# EAGLE design EEZ AUX PS r4B42 (EAGLE 6.1)
Assembly variants: Farnell, TME

## Sheet 1 of 2
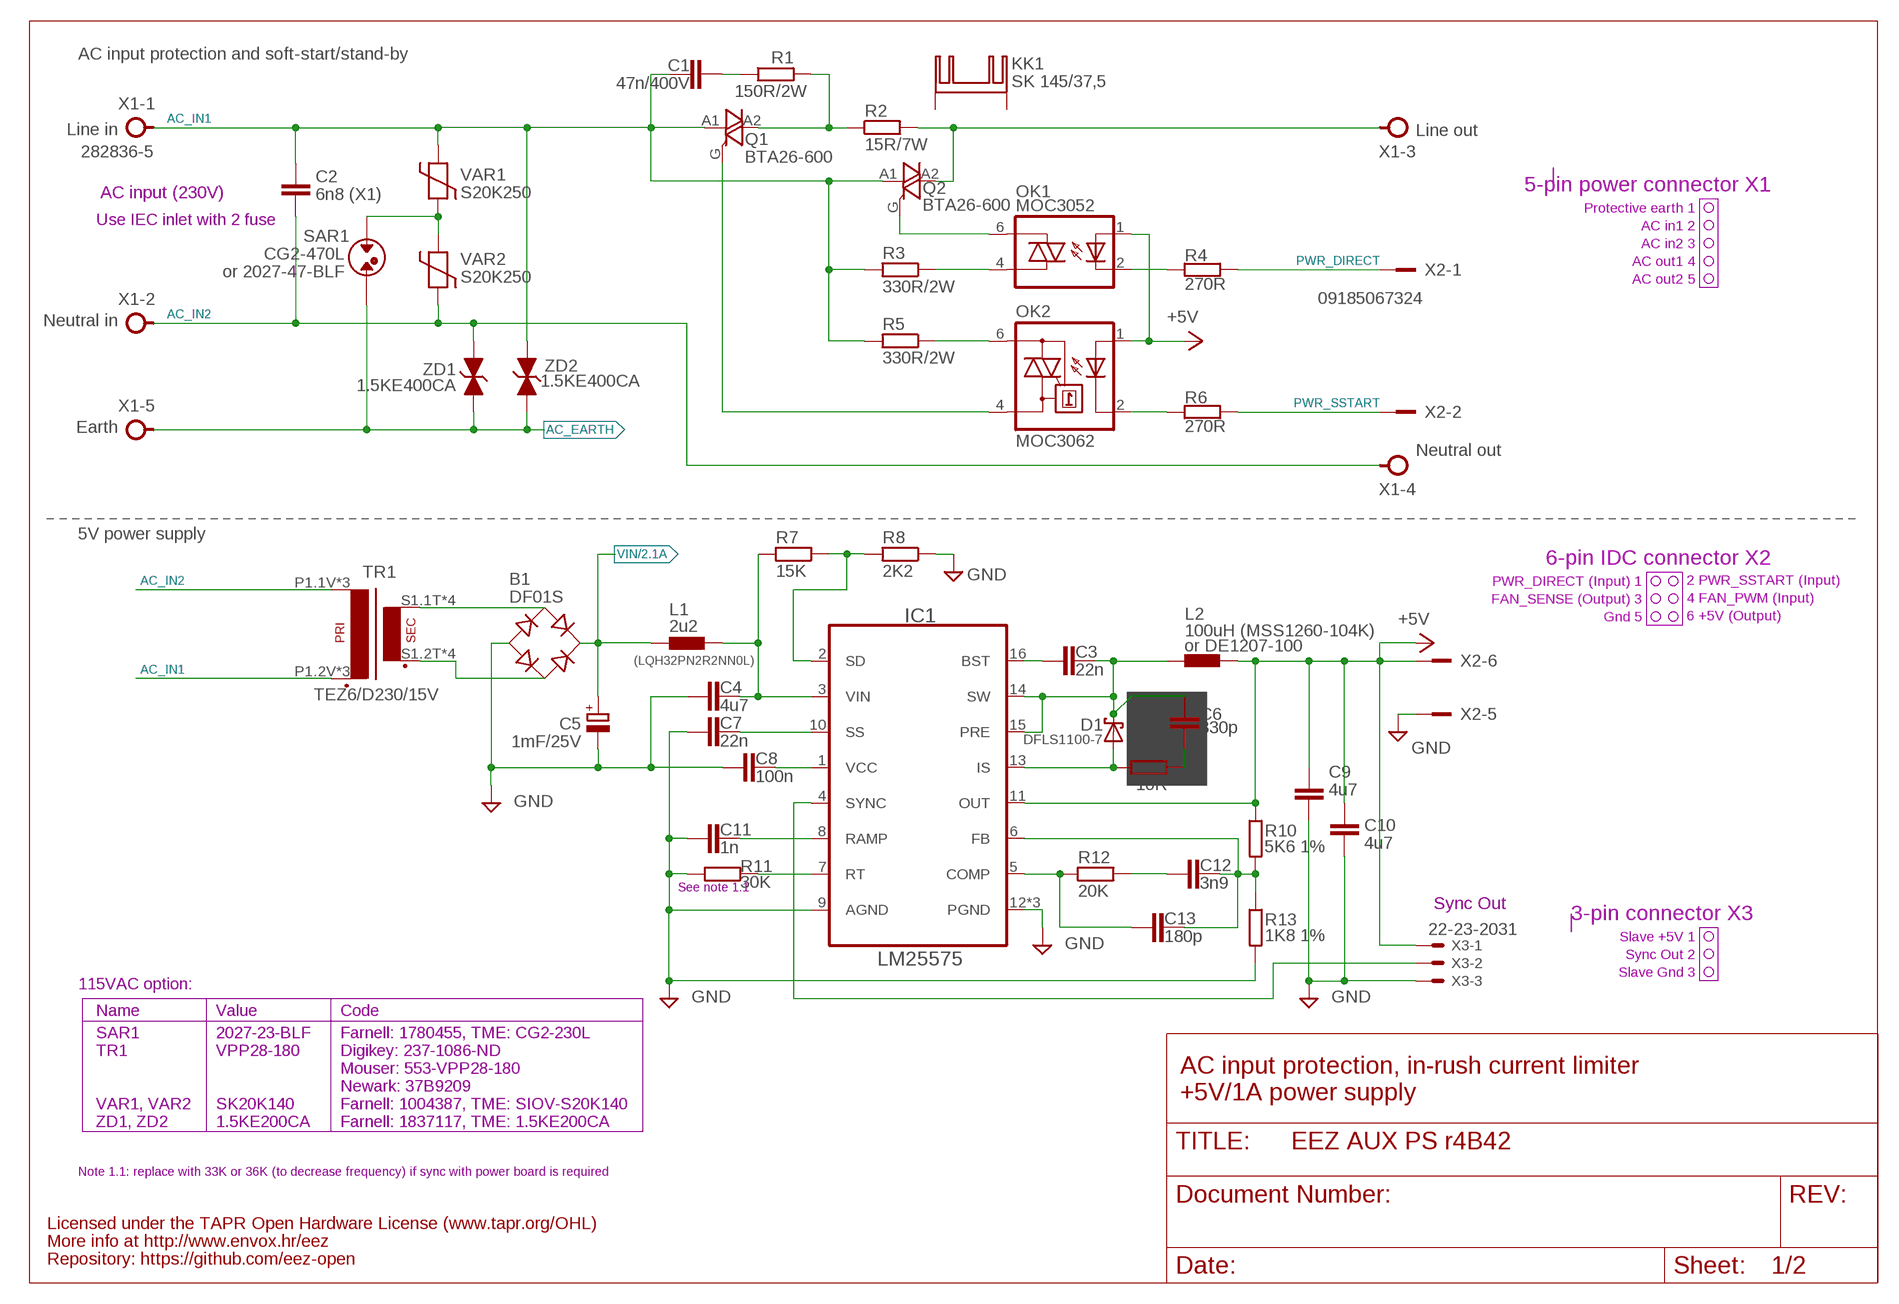
[diagram p0: schematic, sheet 1]

### Parts
B1  DF01S  [DFS]
C1  47n/400V  C-EU075-052X106  [C075-052X106]
C2  6n8 (X1)  C-EU102-064X133  [C102-064X133]
C3  22n  C-EUC0805  [C0805]
C4  4u7  C-EUC1210  [C1210]
C5  1mF/25V  ECAP5G_10.5MM  [ECAP5/10.5]
C6  330p  C-EUC0805  [C0805]
C7  22n  C-EUC0805  [C0805]
C8  100n  C-EUC0805  [C0805]
C9  4u7  C-EUC1210  [C1210]
C10  4u7  C-EUC1210  [C1210]
C11  1n  C-EUC0805  [C0805]
C12  3n9  C-EUC0805  [C0805]
C13  180p  C-EUC0805  [C0805]
D1  DFLS1100-7  SCHOTTKYSOD123  [SOD123]
IC1  LM25575  LM(2)5575  [SOP65P640X110-17N_HOLE]
KK1  SK 145/37,5  SK145  [SK145]
L1  2u2  L1210  [L1210]
L2  100uH (MSS1260-104K)  COILCRAFT_MSS1278  [MSS1278]
OK1  MOC3052  MOC305X  [DIL6-SMD]
OK2  MOC3062  MOC3033S  [DIL6-SMD]
Q1  BTA26-600  BTA26-V  [TOP3S-1]
Q2  BTA26-600  BTA26-V  [TOP3S-1]
R1  150R/2W  R-EU_R2512  [R2512]
R2  15R/7W  R_EU7W  [R_0913]
R3  330R/2W  R-EU_R2512  [R2512]
R4  270R  R-EU_R0805  [R0805]
R5  330R/2W  R-EU_R2512  [R2512]
R6  270R  R-EU_R0805  [R0805]
R7  15K  R-EU_R0805  [R0805]
R8  2K2  R-EU_R0805  [R0805]
R9  10R  R-EU_R1206  [R1206]
R10  5K6 1%  R-EU_R0805  [R0805]
R11  30K  R-EU_R0805  [R0805]
R12  20K  R-EU_R0805  [R0805]
R13  1K8 1%  R-EU_R0805  [R0805]
SAR1  CG2-470L  SAR  [SAR]
TR1  TEZ6/D230/15V  PCB_TRAFO6VA_TEZ+VPP  [PCB_TRAFO6VA_TEZ+VPP]
VAR1  S20K250  VARISTOR  [VARISTOR]
VAR2  S20K250  VARISTOR  [VARISTOR]
X1  282836-5  TBLOCK5.0_5A  [TBLOCK5.0_5]
X2  09185067324  IDC-6PIN  [IDC-6PIN]
X3  22-23-2031  [22-23-2031]
ZD1  1.5KE400CA  1.5KE-BIDIR  [DO201-BIDIR]
ZD2  1.5KE400CA  1.5KE-BIDIR  [DO201-BIDIR]

### Nets
+5V: C9.1 C10.1 IC1.11(OUT) L2.2 OK1.1(A) OK2.1(A) R10.1 X2.6 X3.1 ; also sheet 2
AC_EARTH: SAR1.P$2 X1.5 ZD1.C ZD2.C
AC_IN1: C1.2 C2.1 Q1.A1 Q2.A1 R3.2 R5.2 TR1.P1.2V(P2) TR1.P2.2V(P2) TR1.P2_TEZ(P2) VAR1.P$2 X1.1 ZD2.A
AC_IN2: C2.2 TR1.P1.1V(P1) TR1.P1_TEZ(P1) TR1.P2.1V(P1) VAR2.P$1 X1.2 X1.4 ZD1.A
DC_PREG1: C4.1 IC1.3(VIN) L1.2 R7.2
GND [gnd]: B1.- C4.2 C5.- C7.2 C8.1 C9.2 C10.2 C11.1 IC1.9(AGND) IC1.12(PGND) IC1.TP2(PGND) IC1.TP(PGND) R8.1 R11.2 R13.2 X2.5 X3.3 ; also sheet 2
IS: D1.A IC1.13(IS) R9.1
N$1: C6.2 R9.2
N$2: OK1.6(A2) Q2.G
N$3: OK1.4(A1) R3.1
N$4: OK2.4(A1) Q1.G
N$5: OK1.2(C) R4.1
N$6: OK2.2(C) R6.1
N$7: OK2.6(A2) R5.1
N$8: Q2.A2 R2.2 X1.3
N$9: B1.AC1 TR1.S1.1T(S1) TR1.S1.1V(S1) TR1.S2.1T(S1) TR1.S2.1V(S1)
N$13: IC1.4(SYNC) X3.2
N$15: C1.1 R1.1
N$20: B1.AC2 TR1.S1.2T(S2) TR1.S1.2V(S2) TR1.S2.2T(S2) TR1.S2.2V(S2)
N$25: Q1.A2 R1.2 R2.1
N$77: C12.2 R12.2
N$114: SAR1.P$1 VAR1.P$1 VAR2.P$2
N$128: C12.1 C13.1 IC1.6(FB) R10.2 R13.1
N$131: C3.2 IC1.16(BST)
N$135: C13.2 IC1.5(COMP) R12.1
N$165: IC1.7(RT) R11.1
N$166: C8.2 IC1.1(VCC)
N$167: C11.2 IC1.8(RAMP)
N$168: C7.1 IC1.10(SS)
N$180: IC1.2(SD) R7.1 R8.2
PWR_DIRECT: R4.2 X2.1
PWR_SSTART: R6.2 X2.2
SW: C3.1 C6.1 D1.C IC1.14(SW) IC1.15(PRE) L2.1
VIN: B1.+ C5.+ L1.1 ; also sheet 2
Unconnected: KK1.1(K) KK1.2(K)

### Notes on the sheet
- AC input protection and soft-start/stand-by
- Line in
- Line out
- 5-pin power connector X1
- AC input (230V)
- Protective earth 1
- AC in1 2
- Use IEC inlet with 2 fuse
- AC in2 3
- AC out1 4
- or 2027-47-BLF
- AC out2 5
- Neutral in
- Earth
- Neutral out
- 5V power supply
- 6-pin IDC connector X2
- PWR_DIRECT (Input) 1
- 2 PWR_SSTART (Input)
- FAN_SENSE (Output) 3
- 4 FAN_PWM (Input)
- Gnd 5
- 6 +5V (Output)
- or DE1207-100
- (LQH32PN2R2NN0L)
- See note 1.1
- Sync Out | 3-pin connector X3
- Slave +5V 1
- Sync Out 2
- Slave Gnd 3
- 115VAC option:
- Name | Value | Code
- SAR1 | 2027-23-BLF | Farnell: 1780455, TME: CG2-230L
- TR1 | VPP28-180 | Digikey: 237-1086-ND
- Mouser: 553-VPP28-180 | AC input protection, in-rush current limiter
- Newark: 37B9209
- +5V/1A power supply
- VAR1, VAR2 | SK20K140 | Farnell: 1004387, TME: SIOV-S20K140
- ZD1, ZD2 | 1.5KE200CA | Farnell: 1837117, TME: 1.5KE200CA
- Note 1.1: replace with 33K or 36K (to decrease frequency) if sync with power board is required
- Licensed under the TAPR Open Hardware License (www.tapr.org/OHL)
- More info at http://www.envox.hr/eez
- Repository: https://github.com/eez-open

## Sheet 2 of 2
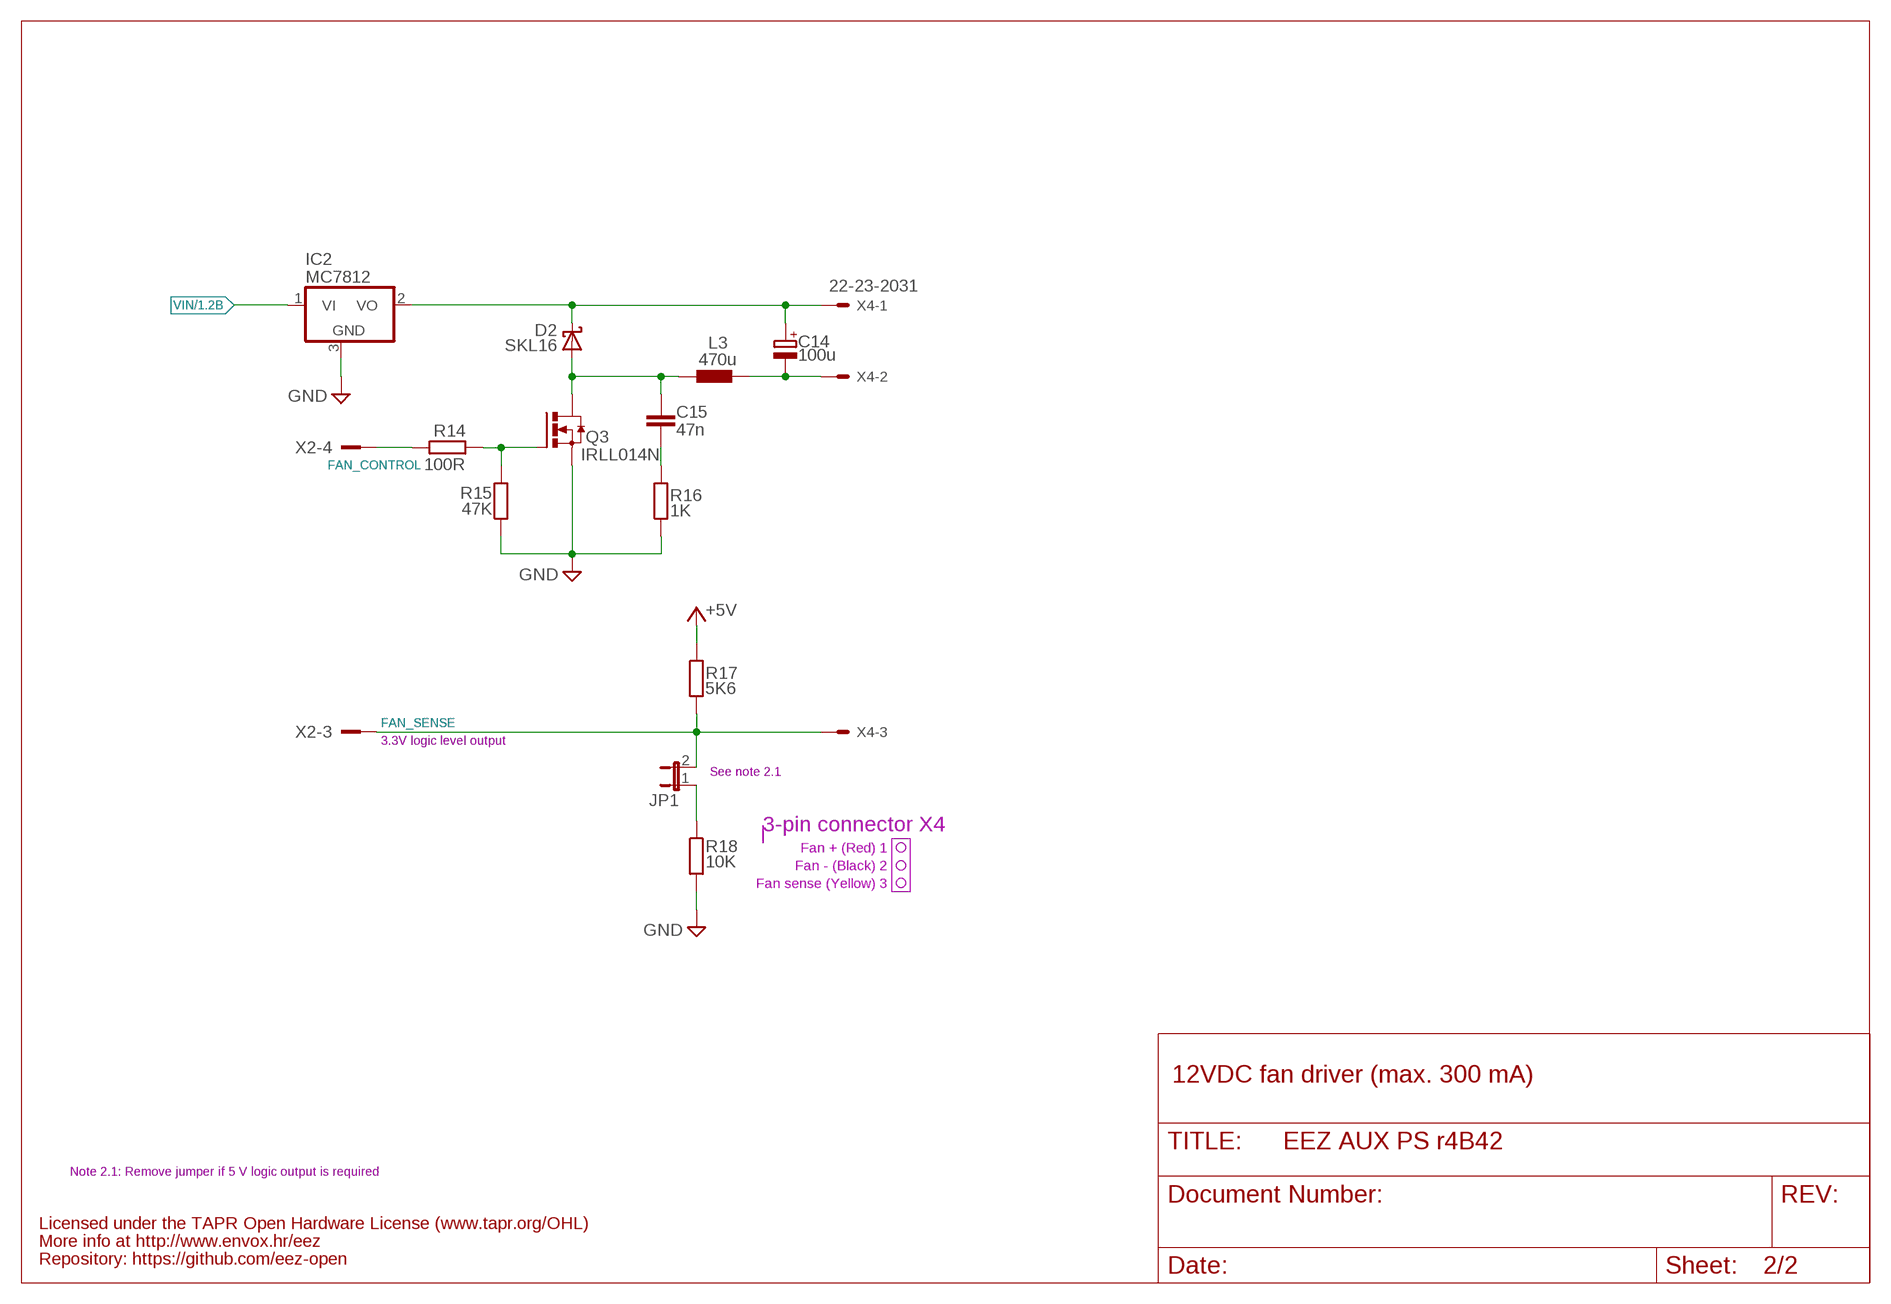
[diagram p1: schematic, sheet 2]

### Parts
C14  100u  ECAPPANASONIC_H  [CAPAE660X610N]
C15  47n  C-EUC0805  [C0805]
D2  SKL16  SCHOTTKYSOD123  [SOD123]
IC2  MC7812  MC78XX  [TO252]
JP1  JP1E  [JP1]
L3  470u  DE0704  [DE0704]
Q3  IRLL014N  N-HEXFET-2D_SOT232-IRLL014N  [SOT223]
R14  100R  R-EU_R0805  [R0805]
R15  47K  R-EU_R0805  [R0805]
R16  1K  R-EU_R0805  [R0805]
R17  5K6  R-EU_R0805  [R0805]
R18  10K  R-EU_R0805  [R0805]
X4  22-23-2031  [22-23-2031]

### Nets
+5V: R17.1 ; also sheet 1
FAN_CONTROL: R14.2 X2.4
FAN_OUT: C15.2 D2.A L3.2 Q3.2(D) Q3.4(D)
FAN_SENSE: JP1.2 R17.2 X2.3 X4.3
GND [gnd]: IC2.3(GND) Q3.3(S) R15.1 R16.1 R18.2 ; also sheet 1
N$10: JP1.1 R18.1
N$12: C15.1 R16.2
N$17: Q3.1(G) R14.1 R15.2
N$19: C14.1(+) D2.C IC2.2(VO) X4.1
N$21: C14.2(-) L3.1 X4.2
VIN: IC2.1(VI) ; also sheet 1

### Notes on the sheet
- 3.3V logic level output
- See note 2.1
- 3-pin connector X4
- Fan + (Red) 1
- Fan - (Black) 2
- Fan sense (Yellow) 3
- 12VDC fan driver (max. 300 mA)
- Note 2.1: Remove jumper if 5 V logic output is required
- Licensed under the TAPR Open Hardware License (www.tapr.org/OHL)
- More info at http://www.envox.hr/eez
- Repository: https://github.com/eez-open

## Library data of the parts
B1 = rectifier:DF*S: Surface Mount Glass Passivated Bridge Rectifiers Source: Source: Comchip Bridge Rectifiers DF005S-G thru DF10S-G.pdf
C1-C4 C6-C13 C15 = rcl:C-EU: CAPACITOR, European symbol
C5 C14 = EEZ_Lib1:ECAP
D1 D2 = EEZ_Lib1:SCHOTTKY
IC1 = EEZ_Lib1:LM(2)5575: Simple Switcher® 42V, 1.5A Step-Down Switching Regulator
IC2 = EEZ_Lib1:MC78XX: 1.0 A Positive Voltage Regulators
JP1 = jumper:JP1E: JUMPER
KK1 = EEZ_Lib1:SK145: FISCHER ELEKTRONIK SK 145/37,5 STS-220 Heat Sink, TO-220, TO-218, TO-220, TO-247, TO-248, 12 °C/W, 29 mm, 12 mm
L1 = EEZ_Lib1:L1210
L2 = EEZ_Lib1:COILCRAFT_MSS1278: Coilcraft SMT Power Inductors – MSS1278
L3 = EEZ_Lib1:DE0704: Ferrocore SMD power coil 7.3 x 7.3 mm
OK1 = EEZ_Lib1:MOC305X: 6-pin DIP Random-phase Optoisolators Triac Drivers (600V Peak)
OK2 = optocoupler:MOC30*: 6-Pin DIP Zero-Cross Optoisolators Triac Driver Output (250/400 Volt Peak) Source: http://www.fairchildsemi.com/ds/MO/MOC3043-M.pdf; MF: FAIRCHILD SEMICONDUCTOR; MPN: MOC3033S-M; OC_FARNELL: unknown; OC_NEWARK: 05C2878
Q1 Q2 = triac:BTA26: 25A TRIAC Source: http://www.st.com/stonline/products/literature/ds/7470.pdf
Q3 = transistor-power:N-HEXFET-2D_?-*: HEXFET® Power MOSFET 2 Drain connects http://www.irf.com/product-info/datasheets/data/irll014n.pdf
R1 R3-R18 = rcl:R-EU_: RESISTOR, European symbol
R2 = EEZ_Lib1:R_EU: RESISTOR - European symbol
SAR1 = EEZ_Lib1:SAR: EPCOS surge arrester EF470X Farnell: 1886596
TR1 = EEZ_Lib1:PCB_TRAFO6VA_TEZ+VPP: Breve Tufvassons TEZ 6/D or Triad Magnetics VPP; DIGIKEY: 237-1086-ND; MOUSER: 553-VPP28-180; NEWARK: 37B9209; TME: TEZ6/D/15-15V
VAR1 VAR2 = EEZ_Lib1:VARISTOR: EPCOS - B72220S0251K101 - VARISTOR, 140J, 250VAC Farnell: 1004357
X1 = EEZ_Lib1:TBLOCK5.0_5A
X2 = EEZ_Lib1:IDC-6PIN: 6-pin IDC socket male, straight; FARNELL: 1096984; TME: 09185067324
X3 X4 = con-molex:22-23-2031: .100" (2.54mm) Center Header - 3 Pin; MF: MOLEX; MPN: 22-23-2031; OC_FARNELL: 1462950; OC_NEWARK: 30C0862
ZD1 ZD2 = EEZ_Lib1:1.5KE-BIDIR

## Net classes
0 default: width 0.254 mm, drill 0.584 mm, clearance 0.254 mm
1 power: width 0.254 mm, drill 0.584 mm, clearance 0.254 mm
2 gnd: width 0.254 mm, drill 0.584 mm, clearance 0.254 mm

## Board
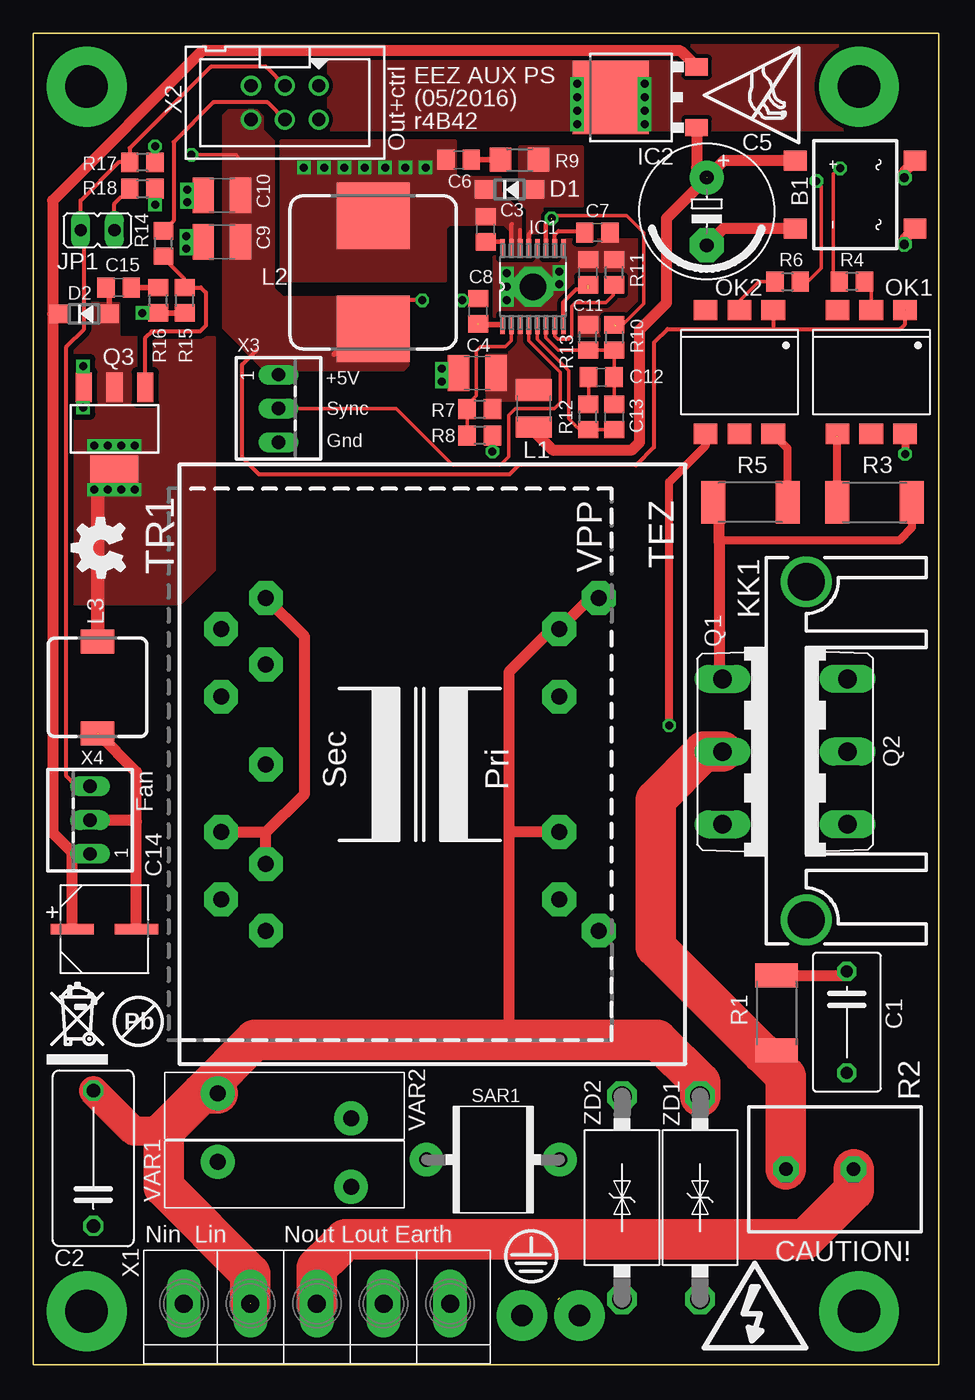
[diagram p2: board, top side]
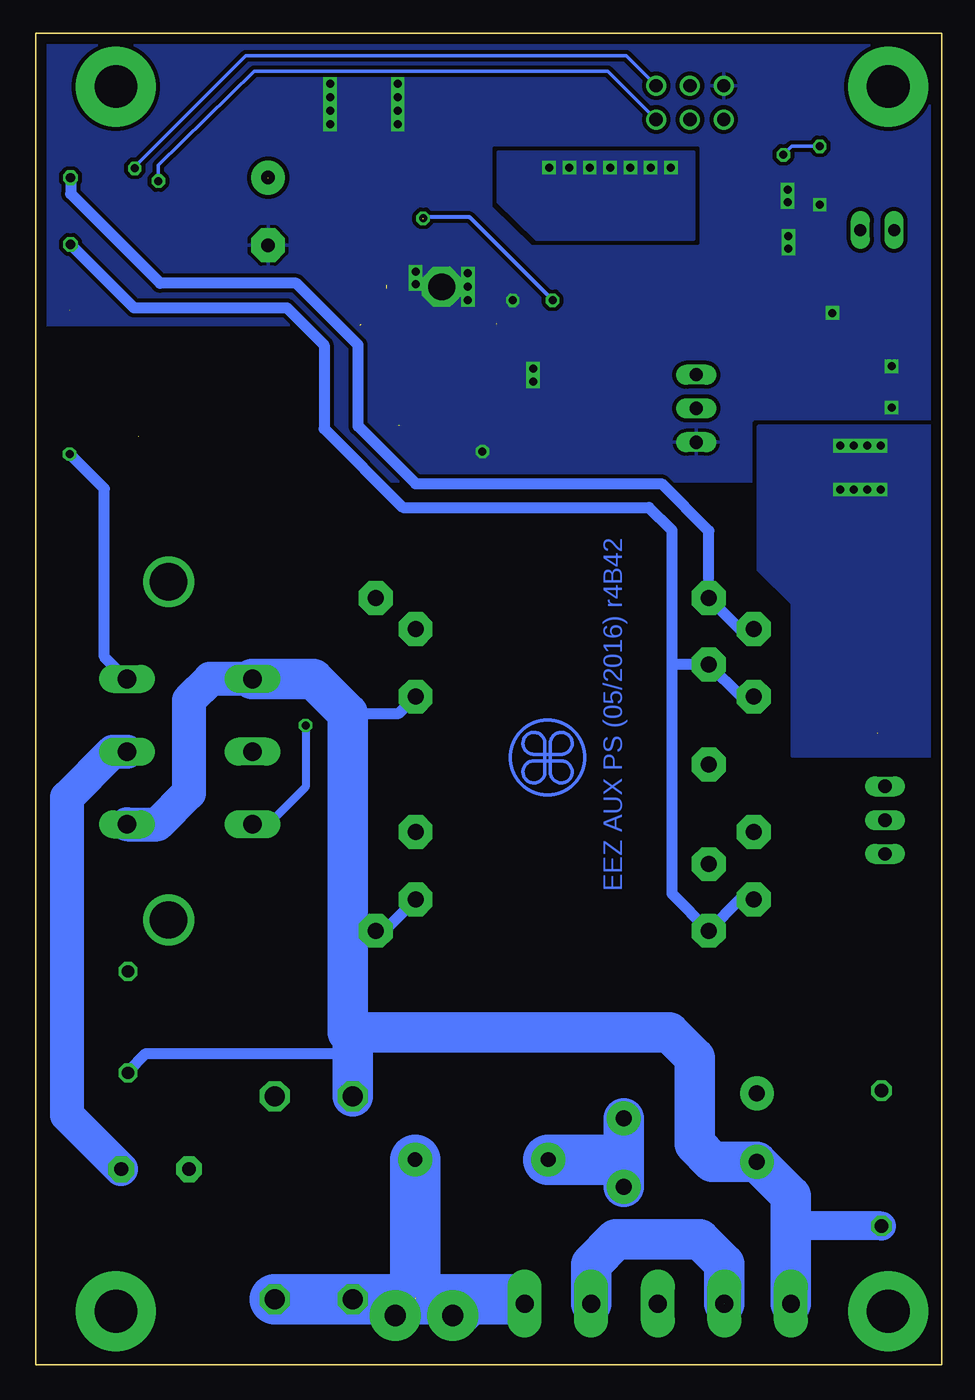
[diagram p3: board, bottom side, seen from below]

Size 68 x 100 mm. Coordinates in mm from the lower left corner, seen from the top.
Outline: 0,0 0,100 68,100 68,0 0,0
Copper layers (1+5*16): Top 0.035mm / dielectric 0.75mm / Route5 0.035mm / dielectric 0.75mm / Bottom 0.035mm
Design rules: minimum track width 10mil, minimum drill 0.5mm, track to track 8mil, track to pad 8mil, pad to pad 8mil, via to via 8mil, smd to smd 8mil, copper to edge 30mil, drill to drill 8mil, minimum pad ring 10mil, minimum via ring 8mil, stop-mask expansion 4mil, vias tented up to drill 25mil, thermal gap 10mil

### Footprints (pad centres in the part's own frame; a part is rotated, then mirrored left to right if it is on the bottom)
DFS = smd 1.5 x 1.7: + -2.55,-4.5; - 2.55,-4.5; AC1 -2.55,4.5; AC2 2.55,4.5
C075-052X106 = drill 0.914 octagon: 1 -3.81,0; 2 3.81,0
C102-064X133 = drill 1.016 octagon: 1 -5.08,0; 2 5.08,0
C0805 = smd 1.3 x 1.5: 1 -0.95,0; 2 0.95,0
C1210 = smd 1.6 x 2.7: 1 -1.4,0; 2 1.4,0
ECAP5/10.5 = drill 1.016 pad 2.54: + -2.54,0 | drill 1.016 pad 2.54 octagon: - 2.54,0
CAPAE660X610N = smd 3.251 x 0.762: 1 -2.413,0; 2 2.413,0
SOD123 = smd 1.4 x 1.4: A 1.9,0; C -1.9,0
SOP65P640X110-17N_HOLE = smd 1.422 x 0.356: 1 -2.845,2.286; 2 -2.845,1.626; 3 -2.845,0.965; 4 -2.845,0.33; 5 -2.845,-0.33; 6 -2.845,-0.965; 7 -2.845,-1.626; 8 -2.845,-2.286; 9 2.845,-2.286; 10 2.845,-1.626; 11 2.845,-0.965; 12 2.845,-0.33; 13 2.845,0.33; 14 2.845,0.965; 15 2.845,1.626; 16 2.845,2.286 | smd 2.032 x 2.032: TP 0,0 | drill 2 octagon: TP2 0,0
TO252 = smd 1.3 x 1.7: 1 -2.285,-5.49; 2 2.285,-5.49 | smd 5.5 x 5.7: 3 0,0.95
JP1 = drill 0.914 long: 1 0,-1.27; 2 0,1.27
SK145 = drill 2.8: 1 -12.7,0; 2 12.7,0
L1210 = smd 1.6 x 2.7: 1 -1.4,0; 2 1.4,0
MSS1278 = smd 5.5 x 5: 1 0,4.25; 2 0,-4.25
DE0704 = smd 2.5 x 1.8: 1 0,3.45; 2 0,-3.45
DIL6-SMD = smd 1.78 x 1.52: 1 -2.54,-4.645; 2 0,-4.645; 3 2.54,-4.645; 4 2.54,4.645; 5 0,4.645; 6 -2.54,4.645
TOP3S-1 = drill 1.397 long: A1 -5.461,-3.175; A2 0,-3.175; G 5.461,-3.175
SOT223 = smd 1.219 x 2.235: 1 -2.311,-3.099; 2 0,-3.099; 3 2.311,-3.099 | smd 3.6 x 2.2: 4 0,3.099
R2512 = smd 1.8 x 3.2: 1 -2.8,0; 2 2.8,0
R_0913 = drill 1.016 pad 1.93 octagon: 1 -3.556,0; 2 1.524,0
R0805 = smd 1.3 x 1.5: 1 -0.95,0; 2 0.95,0
R1206 = smd 1.6 x 1.803: 1 -1.422,0; 2 1.422,0
SAR = drill 1.1 pad 2.54: P$1 0,0; P$2 10,0
PCB_TRAFO6VA_TEZ+VPP = drill 1.2 pad 2.54 octagon: NC -12.5,0; P1.1V 9.525,10.16; P1.2V 9.525,5.08; P1_TEZ 12.5,12.5; P2.1V 9.525,-5.08; P2.2V 9.525,-10.16; P2_TEZ 12.5,-12.5; S1.1T -12.5,12.5; S1.1V -15.875,10.16; S1.2T -12.5,7.5; S1.2V -15.875,5.08; S2.1T -12.5,-7.5; S2.1V -15.875,-5.08; S2.2T -12.5,-12.5; S2.2V -15.875,-10.16
VARISTOR = drill 1.2 pad 2.54: P$1 -5,0.95; P$2 5,-0.95
TBLOCK5.0_5 = drill 1.35 pad 2.54 long: 1 0,0; 2 0,-5; 3 0,-10; 4 0,-15; 5 0,-20
IDC-6PIN = drill 1 pad 1.422: 1 -2.54,-1.27; 2 -2.54,1.27; 3 0,-1.27; 4 0,1.27; 5 2.54,-1.27; 6 2.54,1.27
22-23-2031 = drill 1 long: 1 -2.54,0; 2 0,0; 3 2.54,0
DO201-BIDIR = drill 1.499 octagon: A 7.62,0; C -7.62,0

### Placement (x,y rotation side)
B1  61.72,87.88 270 top
C1  61.09,25.72 270 top
C2  4.51,15.49 90 top
C3  33.97,85.28 270 top
C4  33.34,74.49 180 top
C5  50.57,86.62 270 top
C6  31.94,90.49 0 top
C7  42.35,85.03 0 top
C8  33.4,79.12 270 top
C9  14.16,84.33 180 top
C10  14.16,87.82 180 top
C11  41.66,82.04 270 top
C12  42.65,74.17 180 top
C13  43.62,71.18 270 top
C14  5.33,32.7 0 top
C15  6.41,80.9 180 top
D1  35.75,88.27 0 top
D2  3.81,78.93 0 top
EEZ_SIGNATURE  SIGNATURESMALL  [SIGNATURE_5MM]  29.58,45.59 270 top
IC1  37.53,80.96 90 top
IC2  44.32,95.19 90 top
JP1  4.83,85.22 90 top
KK1  58.04,46.1 270 top
L1  37.59,71.82 90 top
L2  25.53,82.04 0 top
L3  4.83,50.86 180 top
OK1  62.93,74.55 180 top
OK2  53.02,74.55 180 top
Q1  54.93,46.04 270 top
Q2  57.97,46.04 90 top
Q3  6.09,70.29 180 top
R1  55.82,26.42 270 top
R2  60.07,14.67 0 top
R3  63.18,64.77 0 top
R4  61.47,81.34 180 top
R5  53.85,64.77 180 top
R6  56.64,81.34 0 top
R7  33.53,71.75 0 top
R8  33.53,69.79 180 top
R9  36.51,90.49 180 top
R10  43.62,77.15 270 top
R11  43.62,82.04 90 top
R12  41.66,71.18 90 top
R13  41.66,77.15 90 top
R14  9.78,84.2 90 top
R15  11.37,79.95 90 top
R16  9.4,79.95 90 top
R17  8.19,90.3 180 top
R18  8.19,88.33 0 top
SAR1  29.53,15.39 0 top
TR1  29.97,45.09 0 top
U$2  [RECYCLE_BIN1/8]  1.02,22.54 0 top
U$3  [PB_SMALL]  7.88,25.78 0 top
U$4  [ESD_SYMBOL]  57.49,91.79 90 top
VAR1  18.86,14.29 180 top
VAR2  18.86,19.43 0 top
X1  11.3,4.57 90 top
X2  18.89,94.79 180 top
X3  18.41,71.82 270 top
X4  4.25,40.89 90 top
ZD1  50.06,12.54 90 top
ZD2  44.21,12.54 90 top

### Tracks (layer width: path | path; a pad name or v marks a point on that pad's centre or on a via)
+5V  (via drill 0.6)  (3 unrouted)
  Top 0.254: 38.92,86.04 39.18,86.3 44.58,86.3 45.85,85.03 45.85,79.69 44.26,78.11 43.75,78.11 43.69,78.04 | v11.87,90.87 15.24,90.87 15.37,90.74 | v9.14,91.5 R17.1
  Top 0.305: 23.11,76.26 23.05,76.33 23.56,76.33 24.95,77.72 | 24.95,77.72 25.02,77.79 | L2.2 24.89,77.79 24.95,77.72 | v29.21,79.95 27.24,79.95 25.08,77.79 | 16.76,76.2 15.68,75.12 15.68,68.14 16.95,66.86 35.75,66.86 36.45,67.56 45.27,67.56 46.61,68.9 46.61,76.77 47.62,77.79 55.56,77.79 | 55.56,77.79 65.09,77.79 65.47,78.17 OK1.1 | OK2.1 55.56,77.79
  Top 0.356: IC1.11 38.49,85.67 v38.92,86.11
  Top 0.406: 22.61,75.88 23.05,76.33
  Bottom 0.254: v9.14,91.5 11.24,91.5 v11.87,90.87
  Bottom 0.305: v29.21,79.95 35.43,86.17 38.86,86.17 v38.92,86.11
  pour Top (isolate 0.305, no thermals): 14.67,94.17 16.76,94.17 17.21,93.73 17.21,92.71 18.03,91.88 18.03,80.84 18.73,80.14 27.75,80.14 28.13,79.76 28.13,75.06 27.81,74.74 17.4,74.74 14.29,77.85 14.29,93.79
AC_EARTH  (via drill 1.6 pad 3.81)  (1 unrouted)
  Bottom 0.406: 40.32,4.95 41.02,4.95 v41.02,3.68 | 31.94,4.92 31.3,4.92 X1.5
  Bottom 3.81: ZD1.C ZD2.C 39.62,4.92 39.53,5.01 SAR1.P$2 | 35.43,4.92 39.43,4.92 40.32,4.95 | 35.43,4.92 31.94,4.92 | v36.7,3.68 35.43,4.92
AC_IN1
  Top 0.61: R3.2 65.98,62.87 65.02,61.91 51.62,61.91 51.5,61.78
  Top 0.813: R5.2 51.5,64.32 51.5,61.78 51.5,51.75 Q1.A1
  Bottom 0.813: 44.47,45.34 44.6,45.21 | 44.6,32.51 44.53,32.59 TR1.P2_TEZ 41.84,32.59 TR1.P2.2V | 44.6,48.92 40.74,48.92 TR1.P1.2V | C1.2 61.09,22.04 59.75,23.37 44.85,23.37 44.6,24.96
  Bottom 1.27: 11.18,10.41 11.3,10.54
  Bottom 2.184: C2.1 11.18,10.41
  Bottom 2.54: Q1.A1 54.93,51.5 56.51,49.91 56.51,42.93 58.86,40.58 Q2.A1
  Bottom 3.048: Q1.A1 47.18,51.5 44.6,48.92 44.6,45.21 44.6,32.51 44.6,25.34 | 44.6,25.34 44.6,24.96 20.45,24.96 | ZD2.A 44.21,24.94 44.6,25.34 | 20.45,24.96 18.54,23.05 18.54,16.57 17.2,15.24 VAR1.P$2 11.3,12.68 11.3,10.54 X1.1 | 20.45,24.96 20.45,24.89
AC_IN2  (1 unrouted)
  Top 0.813: TR1.P1_TEZ 41.84,57.59 TR1.P1.1V 38.95,55.24 35.71,52.01 35.71,39.81 | 35.71,39.81 35.71,24.47 35.62,24.38 | TR1.P2.1V 35.9,40.01 35.71,39.81
  Top 2.184: 9.78,17.53 7.55,17.53 C2.2
  Top 3.048: ZD1.A 50.06,21.18 46.86,24.38 35.62,24.38 16.64,24.38 12.63,20.38 | VAR2.P$1 12.63,20.38 | X1.2 16.3,6.81 9.78,13.34 9.78,17.53 12.63,20.38
  Bottom 3.048: X1.4 26.3,7.54 24.45,9.4 18.16,9.4 16.32,7.56 16.32,4.57
DC_PREG1
  pour Top (isolate 0.305, no thermals): 35.75,78.11 37.08,78.11 37.08,76.96 38.8,75.25 38.8,72.39 34.03,72.39 34.03,75.82 35.75,75.82
FAN_CONTROL
  Top 0.305: X2.4 17.61,94.81 13.52,94.81 10.54,91.82 10.54,85.91 R14.2
FAN_OUT  (via drill 0.6)
  Top 0.406: D2.A 5.71,80.65 C15.2
  Top 1.016: L3.2 4.83,65.91 6.16,67.25
  other vias: 4.57,65.72 5.59,65.72 6.6,65.72 7.62,65.72 4.57,69.02 5.59,69.02 6.6,69.02 7.62,69.02
  pour Top (isolate 0.406, no thermals): 13.59,77.15 13.59,59.69 11.05,57.15 1.14,57.15 1.14,79.69 6.41,79.69 6.41,77.15
  pour Bottom (isolate 0.406, no thermals): -0.57,45.72 11.18,45.72 11.18,57.15 13.71,59.69 13.71,70.48 -0.57,70.48
FAN_SENSE
  Top 0.305: X2.3 17.48,97.47 13.33,97.47 7.24,91.38 R17.2 | R17.2 | X4.3 3.24,43.43 2.48,44.2 2.48,76.45 3.81,77.79 3.81,84.96 JP1.2 3.55,87.44 6.42,90.3 R17.2
GND  (via drill 0.6)
  Top 0.254: v30.67,74.8 31.62,74.8 C4.2 | v34.48,68.58 R8.1
  Top 0.305: v11.56,87.31 12.25,87.31 C10.2 | C8.1 v32.19,79.95 | v11.49,83.82 12.32,83.82 C9.2 | v9.14,87.12 R18.2
  Top 0.406: v3.75,71.88 3.75,73.39 Q3.3 | v8.19,78.99 R16.1 R15.1
  Top 0.813: B1.- 51.83,85.33 C5.-
  other vias: 11.56,88.27 11.49,84.77 35.56,81.97 35.56,80.96 35.56,79.96 30.67,73.85 39.5,82.09 39.5,81.15 45.91,96.2 40.83,96.2 40.83,95.19 40.83,94.17 45.91,95.19 45.91,94.17 3.75,74.99 45.91,93.15 40.83,93.15
  pour Top (isolate 0.305, no thermals): 34.61,83.19 39.94,83.19 39.94,84.45 45.4,84.45 45.4,77.28 40.83,77.28 40.83,78.74 34.61,78.74
  pour Bottom (isolate 0.305, rank 2): 0.06,100.01 68.01,100.01 68.01,78.11 48.32,78.11 46.73,76.52 46.73,69.22 43.88,66.36 0.06,66.36
  pour Top (isolate 0.305, no thermals): 22.22,100.58 62.42,100.58 62.42,92.77 22.22,92.77
IS
  Top 0.356: IC1.13 37.2,84.89 37.4,85.09
  pour Top (isolate 0.305, no thermals): 37.15,84.07 37.15,86.8 36.51,87.44 36.51,91.44 41.21,91.44 41.21,87.06 38.16,87.06 38.16,85.03 37.4,85.03 37.27,84.9 37.27,84.07
N$1
  Top 0.406: C6.2 R9.2
N$2  (via drill 0.6)
  Top 0.61: OK1.6 v65.47,68.39
  Bottom 0.813: Q2.G 61.21,51.5 62.86,53.15 62.86,65.79 v65.47,68.39
N$3  (1 unrouted)
  Top 0.508: 60.32,69.71 OK1.4
  Top 0.61: R3.1 60.38,69.67 60.32,69.72
N$4  (via drill 0.6)
  Top 0.61: OK2.4 50.48,69.03 47.75,66.29 v47.75,48.01
  Bottom 0.61: v47.75,48.01 47.75,43.37 50.55,40.58 Q1.G
N$5
  Top 0.254: OK1.2 62.93,80.83 R4.1
N$6
  Top 0.254: R6.1 54.48,81.35 53.02,79.88 OK2.2
N$7
  Top 0.61: R5.1 56.65,68.82 OK2.6
N$8
  Top 3.048: R2.2 61.59,13.08 57.91,9.4 23.43,9.4 23.05,9.02 22.67,8.64 21.3,7.27 X1.3
  Bottom 2.54: Q2.A2 62.23,46.04 65.66,42.61 65.66,18.73 R2.2
N$9  (via drill 0.7)
  Top 0.813: TR1.S2.1T 17.47,39.94 | 17.47,39.94 17.47,39.95 20.38,42.86 20.38,54.67 TR1.S1.1T | TR1.S2.1V 17.41,40.01 17.47,39.94 | v65.4,89.15 65.4,89.62 B1.AC1
  Bottom 0.813: TR1.S1.1V 15.13,55.24 TR1.S1.1T 17.47,62.62 21.02,66.17 39.5,66.17 43.81,70.48 43.81,76.58 48.45,81.22 58.67,81.22 65.4,87.95 v65.4,89.15
N$10
  Top 0.305: JP1.1 6.09,87.18 R18.1
N$12
  Top 0.406: C15.1 R16.2
N$13
  Top 0.254: IC1.4 37.2,76.91 39.56,74.55 39.56,72.26 39.11,71.82 36.19,71.82 35.69,71.31 35.69,68.2 35.05,67.56 31.5,67.56 27.24,71.82 X3.2
N$15
  Top 0.813: R1.1 60.77,29.22 C1.1
N$17
  Top 0.305: 9.71,83.38 R14.1 9.78,83.12 11.3,81.6 11.3,80.96 R15.2 12.57,80.9 12.95,80.52 12.95,78.04 12.51,77.6 8.89,77.6 8.38,77.09 8.38,73.42 Q3.1 8.41,73.81
N$19
  Top 0.305: D2.C 1.46,78.93
  Top 0.813: X4.1 3.05,38.35 2.92,38.48 | 2.92,38.48 1.46,39.94 1.46,78.93 1.46,87.44 12.7,98.68 48.6,98.68 IC2.2 | C14.1 2.92,38.48
N$20  (via drill 0.7)
  Top 0.813: v65.4,84.14 65.4,84.52 B1.AC2
  Bottom 0.813: 20.26,52.58 20.26,62.67 21.97,64.39 40.45,64.39 46.35,70.29 46.35,76.58 49.15,79.38 60.64,79.38 v65.4,84.14 | TR1.S2.2V 15.13,34.92 TR1.S2.2T 20.26,35.37 20.26,52.58 | TR1.S1.2V 15.05,50.16 TR1.S1.2T 19.61,52.59 20.26,52.58
N$21  (1 unrouted)
  Top 0.813: C14.2 7.75,40.77 | 7.75,40.77 7.75,44.51 4.83,47.43 4.83,47.37 | X4.2 7.62,40.89 7.75,40.77
N$25
  Top 0.813: R1.2 55.82,23.5 54.79,23.38 54.74,23.37
  Top 3.048: R2.1 56.51,21.65 54.79,23.38 | 54.74,23.37 46.73,31.37 46.73,42.42 50.35,46.04 Q1.A2
N$77
  Top 0.254: C12.2 41.72,72.33 R12.2
N$114
  Bottom 3.048: VAR1.P$1 23.86,15.37 | 23.86,15.37 VAR2.P$2 | 24.34,15.39 23.88,15.39 23.86,15.37
  Bottom 3.81: SAR1.P$1 24.34,15.39
N$128
  Top 0.254: IC1.6 38.49,77.14 39.43,76.2 R13.1 R10.2 43.62,74.36 C12.1 43.62,74.23 C13.1
N$131
  Top 0.356: C3.2 35.17,84.33 35.24,84.26 IC1.16
N$135  (1 unrouted)
  Top 0.254: IC1.5 37.86,77.01 40.19,74.68 40.19,71.06 40.7,70.55 | C13.2 R12.1 41.02,70.23 40.7,70.55
N$165
  Top 0.254: IC1.7 39.15,77.24 39.37,77.03 40.19,77.03 40.45,77.28 40.45,79.5 40.7,79.76 42.99,79.76 43.56,80.33 R11.1
N$166  (1 unrouted)
  Top 0.356: IC1.1 35.06,78.12 35.05,78.11
  Top 0.406: 35.05,78.11 33.46,78.11 C8.2
N$167  (1 unrouted)
  Top 0.305: IC1.8 39.81,79.82 40.77,80.77 41.59,80.77 41.66,80.83
N$168
  Top 0.305: IC1.10 39.15,84.87 39.43,85.15 41.28,85.15 C7.1
N$180
  Top 0.254: IC1.2 35.88,78.12 | 35.88,78.12 35.88,78.17 | 35.88,78.12 35.88,76.9 35.43,76.45 33.59,76.45 33.27,76.14 33.27,72.77 32.58,72.08 R7.1 R8.2
PWR_DIRECT  (via drill 0.6)
  Top 0.254: R4.2 60.07,81.79 60.07,89.47 v60.58,89.85
  Bottom 0.254: v60.58,89.85 60.58,89.98 52.26,98.3 23.67,98.3 X2.1
PWR_SSTART  (via drill 0.6)
  Top 0.254: R6.2 57.66,81.41 58.23,81.41 59.18,82.36 59.18,88.52 v58.8,88.9
  Bottom 0.254: v58.8,88.9 58.8,90.11 51.62,97.16 25.06,97.16 X2.2
SW  (via drill 0.6)
  Top 0.305: IC1.14 36.56,85.23
  Top 0.356: IC1.15 35.9,85.62 35.94,85.66
  Top 0.813: L2.1 25.2,86.29
  other vias: 27.94,89.92 26.41,89.92 24.89,89.92 23.37,89.92 21.84,89.92 20.32,89.92 29.46,89.92
  pour Top (isolate 0.305, no thermals): 18.6,81.41 18.6,91.88 31.69,91.88 31.69,89.15 35.05,89.15 35.05,88.07 36.58,86.55 36.58,85.22 36.51,85.15 36.51,83.25 35.88,83.25 35.88,85.15 35.37,85.66 31.24,85.66 30.92,85.34 30.92,81.41
  pour Bottom (no thermals): 18.6,91.06 18.6,84.52 30.42,84.52 33.27,87.31 33.27,91.06
TA1  (via drill 3.2 pad 6)
  other vias: 4,96
TA2  (via drill 3.2 pad 6)
  other vias: 62,96
TA3  (via drill 3.2 pad 6)
  other vias: 4,4
TA4  (via drill 3.2 pad 6)
  other vias: 62,4
VIN  (1 unrouted)
  Top 0.813: L1.1 37.59,70.55 37.4,70.29 38.99,68.71 44.96,68.71 45.53,69.28 45.53,77.72 47.56,79.76 47.56,86.11 50.61,89.15 | B1.+ 51.85,90.43 C5.+ 49.81,89.91 IC2.1

### Text on the board
Bottom: EEZ AUX PS (05/2016) r4B42
tPlace: EEZ AUX PS | (05/2016) | r4B42 | Out+ctrl | +5V | Sync | Gnd | Fan | Nin Lin | Nout Lout Earth | CAUTION!
_tNames: X2 | R17 | IC2 | C5 | R9 | R18 | C6 | D1 | C10 | B1 | R14 | C3 | C7 | IC1 | C9 | JP1 | C15 | L2 | R6 | R4 | C8 | R11 | D2 | OK2 | OK1 | C11 | R13 | X3 | C4 | R10 | Q3 | R16 | R15 | C12 | R7 | R8 | R12 | C13 | L1 | R5 | R3 | TR1 | L3 | KK1 | Q1 | X4 | Q2 | C14 | R1 | C1 | SAR1 | R2 | VAR2 | ZD2 | ZD1 | VAR1 | C2 | X1